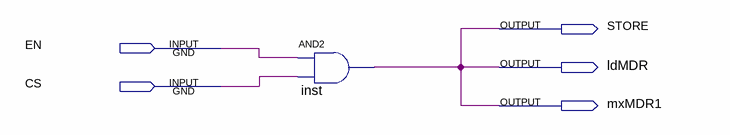
[diagram p0: schematic sheet]
// Quartus schematic STA.bdf as structural Verilog: 1 symbols, 5 pins
module STA (
  input  EN,
  input  CS,
  output STORE,
  output ldMDR,
  output mxMDR1
);

  and inst (ldMDR, EN, CS);

  assign mxMDR1 = ldMDR;
  assign STORE = ldMDR;
endmodule
